# EAGLE design ER-OLED096-Breakout (EAGLE 7.1.0)
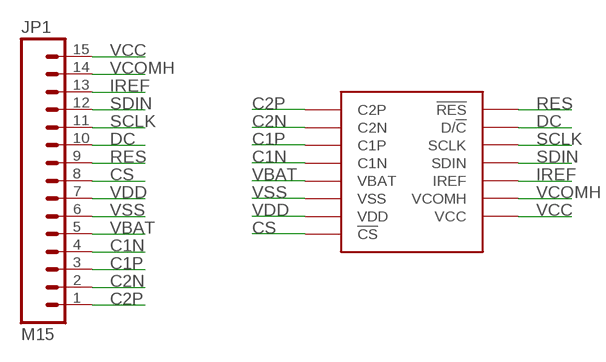
[diagram p0: schematic, sheet 1]

## Parts
JP1  M15  [1X15]
U$1  ER-OLED091  [ER-OLED091]

## Nets
C1N: JP1.4 U$1.C1N
C1P: JP1.3 U$1.C1P
C2N: JP1.2 U$1.C2N
C2P: JP1.1 U$1.C2P
CS: JP1.8 U$1.!CS
DC: JP1.10 U$1.D/!C
IREF: JP1.13 U$1.IREF
RES: JP1.9 U$1.!RES
SCLK: JP1.11 U$1.SCLK
SDIN: JP1.12 U$1.SDIN
VBAT: JP1.5 U$1.VBAT
VCC: JP1.15 U$1.VCC
VCOMH: JP1.14 U$1.VCOMH
VDD: JP1.7 U$1.VDD
VSS: JP1.6 U$1.VSS

## Library data of the parts
JP1 = SparkFun-Connectors:M15: Header 15 Standard 15-pin 0.1" header. Use with straight break away headers (SKU : PRT-00116), right angle break away headers (PRT-00553), swiss pins (PRT-00743), machine pins (PRT-00117), and female headers (PRT-00115).
U$1 = ER-OLED:ER-OLED091

## Board
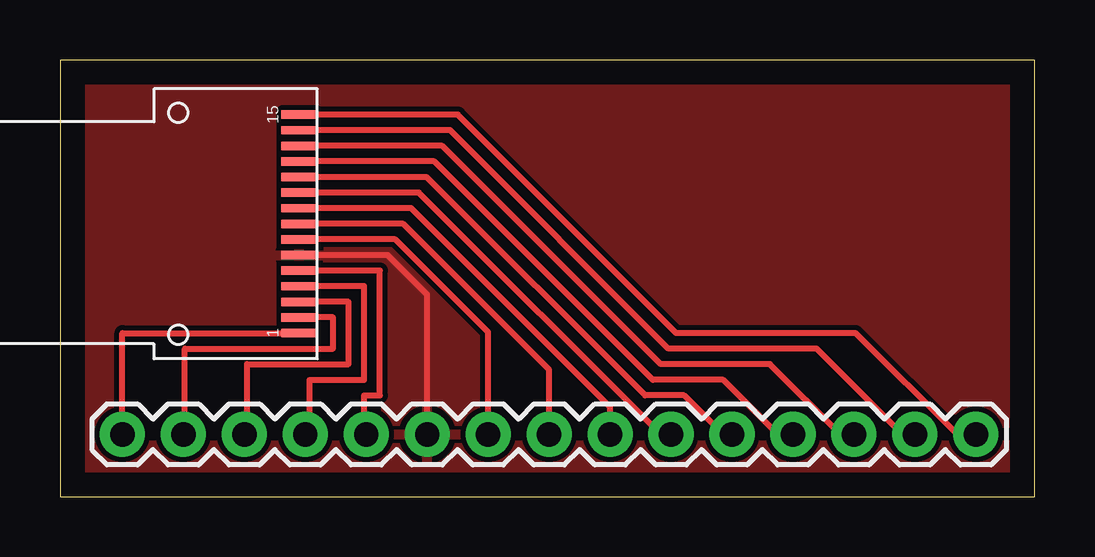
[diagram p1: board, top side]
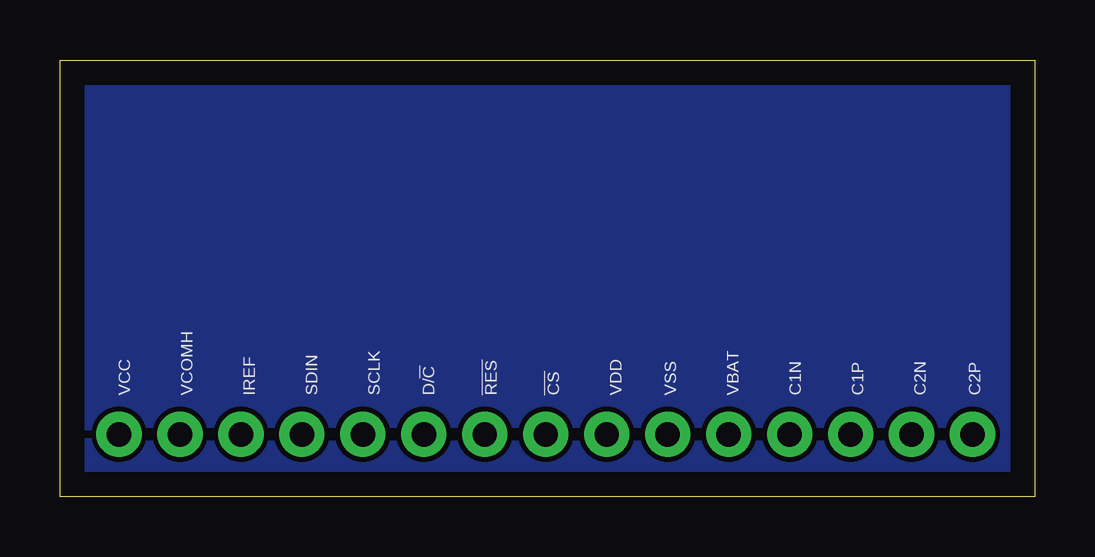
[diagram p2: board, bottom side, seen from below]

Size 40.62 x 18.2 mm. Coordinates in mm from the lower left corner, seen from the top.
Outline: 0,0 40.62,0 40.62,18.2 0,18.2 0,0
Copper layers (1*16): Top 0.035mm / dielectric 1.5mm / Bottom 0.035mm
Design rules "default": minimum track width 10mil, minimum drill 24mil, track to track 8mil, track to pad 8mil, pad to pad 8mil, via to via 8mil, smd to smd 8mil, copper to edge 40mil, drill to drill 8mil, minimum pad ring 10mil, minimum via ring 8mil, stop-mask expansion 4mil, vias tented up to drill 0mil, thermal gap 10mil

### Footprints (pad centres in the part's own frame; a part is rotated, then mirrored left to right if it is on the bottom)
1X15 = drill 1.016 pad 1.88: 1 0,0; 2 2.54,0; 3 5.08,0; 4 7.62,0; 5 10.16,0; 6 12.7,0; 7 15.24,0; 8 17.78,0; 9 20.32,0; 10 22.86,0; 11 25.4,0; 12 27.94,0; 13 30.48,0; 14 33.02,0; 15 35.56,0
ER-OLED091 = smd 0.35 x 1.5: !CS 0,0.75; !RES 0.65,0.75; C1N -2.6,0.75; C1P -3.25,0.75; C2N -3.9,0.75; C2P -4.55,0.75; D/!C 1.3,0.75; IREF 3.25,0.75; SCLK 1.95,0.75; SDIN 2.6,0.75; VBAT -1.95,0.75; VCC 4.55,0.75; VCOMH 3.9,0.75; VDD -0.65,0.75; VSS -1.3,0.75

### Placement (x,y rotation side)
JP1  2.6,2.6 0 top
U$1  10.72,11.38 90 top

### Tracks (layer width: path | path; a pad name or v marks a point on that pad's centre or on a via)
C1N
  Top 0.254: JP1.4 10.4,2.6 10.4,4.88 12.68,4.88 12.68,8.78 U$1.C1N
C1P
  Top 0.254: JP1.3 7.8,2.6 7.8,5.53 12.03,5.53 12.03,8.12 U$1.C1P
C2N
  Top 0.254: JP1.2 5.2,2.6 5.2,6.17 11.38,6.17 11.38,7.47 U$1.C2N
C2P
  Top 0.254: JP1.1 2.6,6.83 U$1.C2P
CS
  Top 0.254: JP1.8 20.38,5.29 14.3,11.38 U$1.!CS
DC
  Top 0.254: JP1.10 25.02,2.6 14.95,12.68 U$1.D/!C
IREF
  Top 0.254: JP1.13 32.5,2.6 29.57,5.53 25.02,5.53 15.93,14.62 U$1.IREF
N$1
  pour Bottom: 0,18.2 0,0 40.62,0 40.62,18.2
RES
  Top 0.254: JP1.9 22.92,3.73 14.62,12.03 U$1.!RES
SCLK
  Top 0.254: JP1.11 27.62,2.6 26,4.22 24.38,4.22 15.28,13.32 U$1.SCLK
SDIN
  Top 0.254: JP1.12 29.9,2.6 27.62,4.88 24.7,4.88 15.6,13.97 U$1.SDIN
VBAT
  Top 0.254: JP1.5 12.68,2.6 12.68,4.22 13.32,4.22 13.32,9.43 U$1.VBAT
VCC
  Top 0.254: JP1.15 37.38,2.6 33.15,6.83 25.68,6.83 16.57,15.93 U$1.VCC
VCOMH
  Top 0.254: JP1.14 35.1,2.6 31.52,6.17 25.35,6.17 16.25,15.28 U$1.VCOMH
VDD
  Top 0.254: JP1.7 17.84,6.86 13.97,10.72 U$1.VDD
VSS
  Top 0.254: JP1.6 15.3,8.43 13.65,10.07 U$1.VSS
  pour Top: 0,18.2 0,0 40.62,0 40.62,18.2

### Text on the board
bPlace: C2P | C2N | C1P | C1N | VBAT | VSS | VDD | !CS | !RES | D/!C | SCLK | SDIN | IREF | VCOMH | VCC